# EAGLE design Led Matrix (EAGLE 5.11)
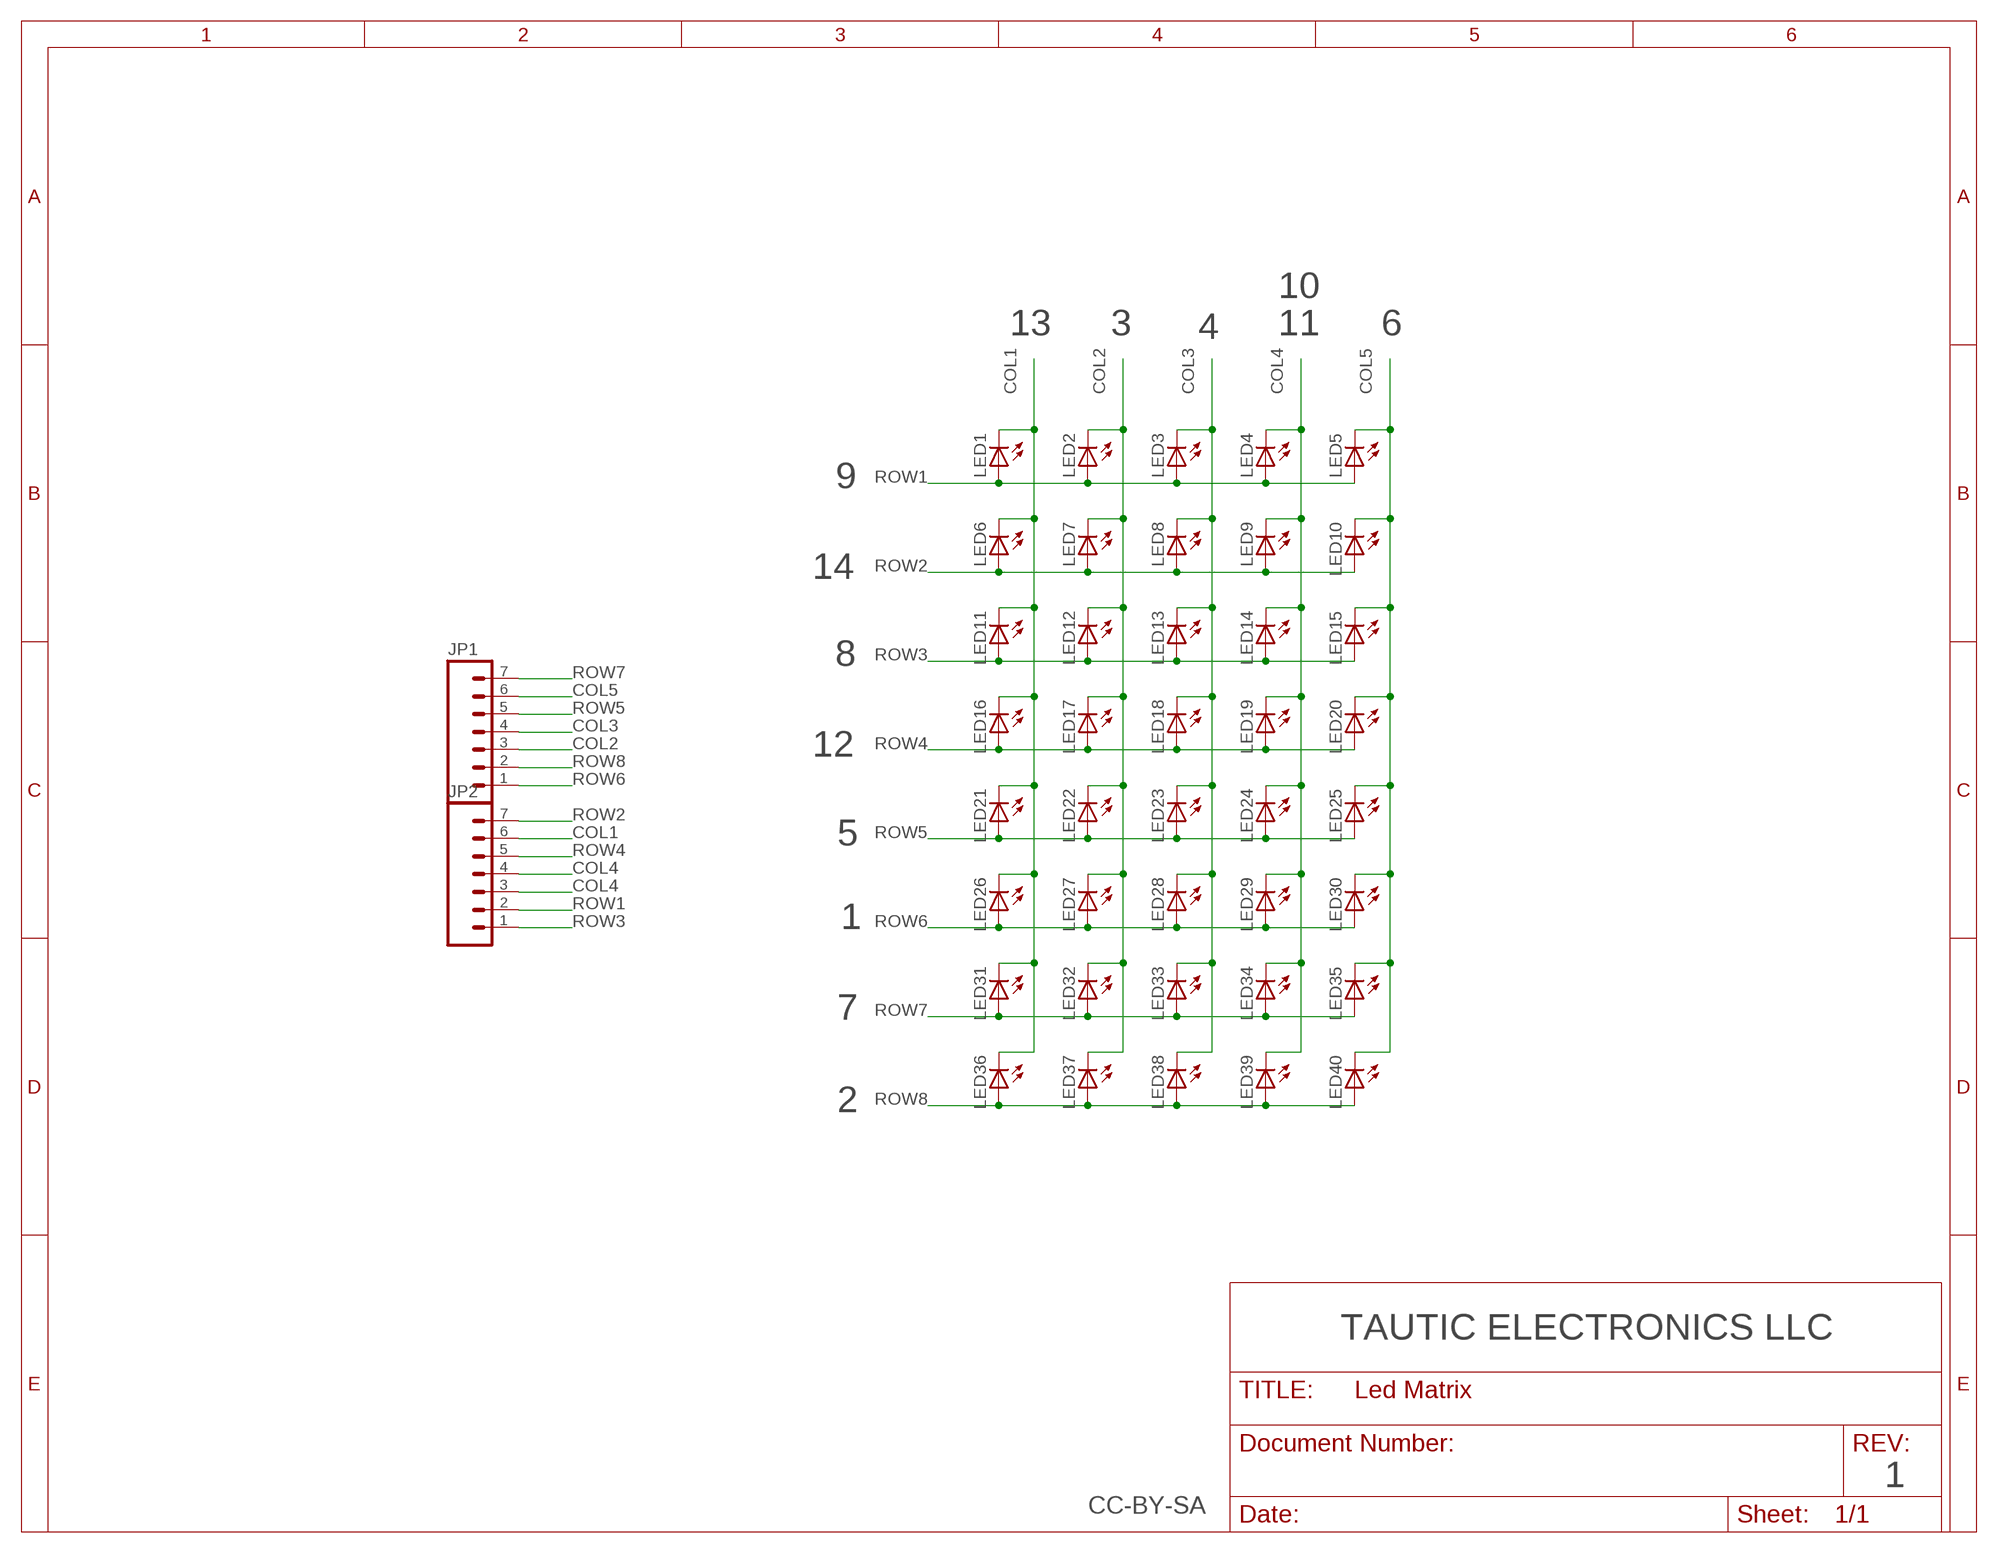
[diagram p0: schematic, sheet 1]

## Parts
JP1  M07LOCK  [1X07_LOCK]
JP2  M07LOCK  [1X07_LOCK]
LED1  LED5MM  [LED5MM]
LED2  LED5MM  [LED5MM]
LED3  LED5MM  [LED5MM]
LED4  LED5MM  [LED5MM]
LED5  LED5MM  [LED5MM]
LED6  LED5MM  [LED5MM]
LED7  LED5MM  [LED5MM]
LED8  LED5MM  [LED5MM]
LED9  LED5MM  [LED5MM]
LED10  LED5MM  [LED5MM]
LED11  LED5MM  [LED5MM]
LED12  LED5MM  [LED5MM]
LED13  LED5MM  [LED5MM]
LED14  LED5MM  [LED5MM]
LED15  LED5MM  [LED5MM]
LED16  LED5MM  [LED5MM]
LED17  LED5MM  [LED5MM]
LED18  LED5MM  [LED5MM]
LED19  LED5MM  [LED5MM]
LED20  LED5MM  [LED5MM]
LED21  LED5MM  [LED5MM]
LED22  LED5MM  [LED5MM]
LED23  LED5MM  [LED5MM]
LED24  LED5MM  [LED5MM]
LED25  LED5MM  [LED5MM]
LED26  LED5MM  [LED5MM]
LED27  LED5MM  [LED5MM]
LED28  LED5MM  [LED5MM]
LED29  LED5MM  [LED5MM]
LED30  LED5MM  [LED5MM]
LED31  LED5MM  [LED5MM]
LED32  LED5MM  [LED5MM]
LED33  LED5MM  [LED5MM]
LED34  LED5MM  [LED5MM]
LED35  LED5MM  [LED5MM]
LED36  LED5MM  [LED5MM]
LED37  LED5MM  [LED5MM]
LED38  LED5MM  [LED5MM]
LED39  LED5MM  [LED5MM]
LED40  LED5MM  [LED5MM]

## Nets
COL1: JP2.6 LED1.K(C) LED6.K(C) LED11.K(C) LED16.K(C) LED21.K(C) LED26.K(C) LED31.K(C) LED36.K(C)
COL2: JP1.3 LED2.K(C) LED7.K(C) LED12.K(C) LED17.K(C) LED22.K(C) LED27.K(C) LED32.K(C) LED37.K(C)
COL3: JP1.4 LED3.K(C) LED8.K(C) LED13.K(C) LED18.K(C) LED23.K(C) LED28.K(C) LED33.K(C) LED38.K(C)
COL4: JP2.3 JP2.4 LED4.K(C) LED9.K(C) LED14.K(C) LED19.K(C) LED24.K(C) LED29.K(C) LED34.K(C) LED39.K(C)
COL5: JP1.6 LED5.K(C) LED10.K(C) LED15.K(C) LED20.K(C) LED25.K(C) LED30.K(C) LED35.K(C) LED40.K(C)
ROW1: JP2.2 LED1.A LED2.A LED3.A LED4.A LED5.A
ROW2: JP2.7 LED6.A LED7.A LED8.A LED9.A LED10.A
ROW3: JP2.1 LED11.A LED12.A LED13.A LED14.A LED15.A
ROW4: JP2.5 LED16.A LED17.A LED18.A LED19.A LED20.A
ROW5: JP1.5 LED21.A LED22.A LED23.A LED24.A LED25.A
ROW6: JP1.1 LED26.A LED27.A LED28.A LED29.A LED30.A
ROW7: JP1.7 LED31.A LED32.A LED33.A LED34.A LED35.A
ROW8: JP1.2 LED36.A LED37.A LED38.A LED39.A LED40.A

## Notes on the sheet
- 10
- 13 | 3 | 4 | 11 | 6
- 9
- 14
- 8
- 12
- 5
- 1
- 7
- 2
- TAUTIC ELECTRONICS LLC
- 1
- CC-BY-SA

## Library data of the parts
JP1 JP2 = SparkFun:M07: Header 7 Standard 7-pin 0.1" header. Use with straight break away headers (SKU : PRT-00116), right angle break away headers (PRT-00553), swiss pins (PRT-00743), machine pins (PRT-00117), and female headers (PRT-00115). NOTES ON THE VARIANTS LOCK and LOCK_LONGPADS... This footprint was designed to help hold the alignment of a through-hole component (i.e. 7-pin header) while soldering it into place. You may notice that each hole has been shifted either up or down by 0.005 of an inch from it's more standard position (which is usually a perfectly straight line). This slight alteration caused the pins (the squares in the middle) to touch the edges of the holes. Because they are alternating, it causes a "brace" to hold the header in place. 0.005 has proven to be the perfect amount of "off-center" position when using our standard breakaway headers. Although looks a little odd when you look at the bare footprint, once you have a header in there, the alteration is very hard to notice. Also, if you push a header all the way into place, it is covered up entirely on the bottom side. This idea of altering the position of holes to aid alignment will be further integrated into the Sparkfun Library for other footprints. It can help hold any component with 3 or more connection pins.
LED1-LED40 = led:LED: LED OSRAM: - CHIPLED LG R971, LG N971, LY N971, LG Q971, LY Q971, LO R971, LY R971 LH N974, LH R974 LS Q976, LO Q976, LY Q976 LO Q996 - Hyper CHIPLED LW Q18S LB Q993, LB Q99A, LB R99A - SideLED LS A670, LO A670, LY A670, LG A670, LP A670 LB A673, LV A673, LT A673, LW A673 LH A674 LY A675 LS A676, LA A676, LO A676, LY A676, LW A676 LS A679, LY A679, LG A679 - Hyper Micro SIDELED® LS Y876, LA Y876, LO Y876, LY Y876 LT Y87S - SmartLED LW L88C, LW L88S LB L89C, LB L89S, LG L890 LS L89K, LO L89K, LY L89K LS L896, LA L896, LO L896, LY L896 - TOPLED LS T670, LO T670, LY T670, LG T670, LP T670 LSG T670, LSP T670, LSY T670, LOP T670, LYG T670 LG T671, LOG T671, LSG T671 LB T673, LV T673, LT T673, LW T673 LH T674 LS T676, LA T676, LO T676, LY T676, LB T676, LH T676, LSB T676, LW T676 LB T67C, LV T67C, LT T67C, LS T67K, LO T67K, LY T67K, LW E67C LS E67B, LA E67B, LO E67B, LY E67B, LB E67C, LV E67C, LT E67C LW T67C LS T679, LY T679, LG T679 LS T770, LO T770, LY T770, LG T770, LP T770 LB T773, LV T773, LT T773, LW T773 LH T774 LS E675, LA E675, LY E675, LS T675 LS T776, LA T776, LO T776, LY T776, LB T776 LHGB T686 LT T68C, LB T68C - Hyper Mini TOPLED® LB M676 - Mini TOPLED Santana® LG M470 LS M47K, LO M47K, LY M47K Source: http://www.osram.convergy.de LUXEON: - LUMILED® LXK2-PW12-R00, LXK2-PW12-S00, LXK2-PW14-U00, LXK2-PW14-V00 LXK2-PM12-R00, LXK2-PM12-S00, LXK2-PM14-U00 LXK2-PE12-Q00, LXK2-PE12-R00, LXK2-PE12-S00, LXK2-PE14-T00, LXK2-PE14-U00 LXK2-PB12-K00, LXK2-PB12-L00, LXK2-PB12-M00, LXK2-PB14-N00, LXK2-PB14-P00, LXK2-PB14-Q00 LXK2-PR12-L00, LXK2-PR12-M00, LXK2-PR14-Q00, LXK2-PR14-R00 LXK2-PD12-Q00, LXK2-PD12-R00, LXK2-PD12-S00 LXK2-PH12-R00, LXK2-PH12-S00 LXK2-PL12-P00, LXK2-PL12-Q00, LXK2-PL12-R00 Source: www.luxeon.com KINGBRIGHT: KA-3528ASYC Source: www.kingbright.com

## Board
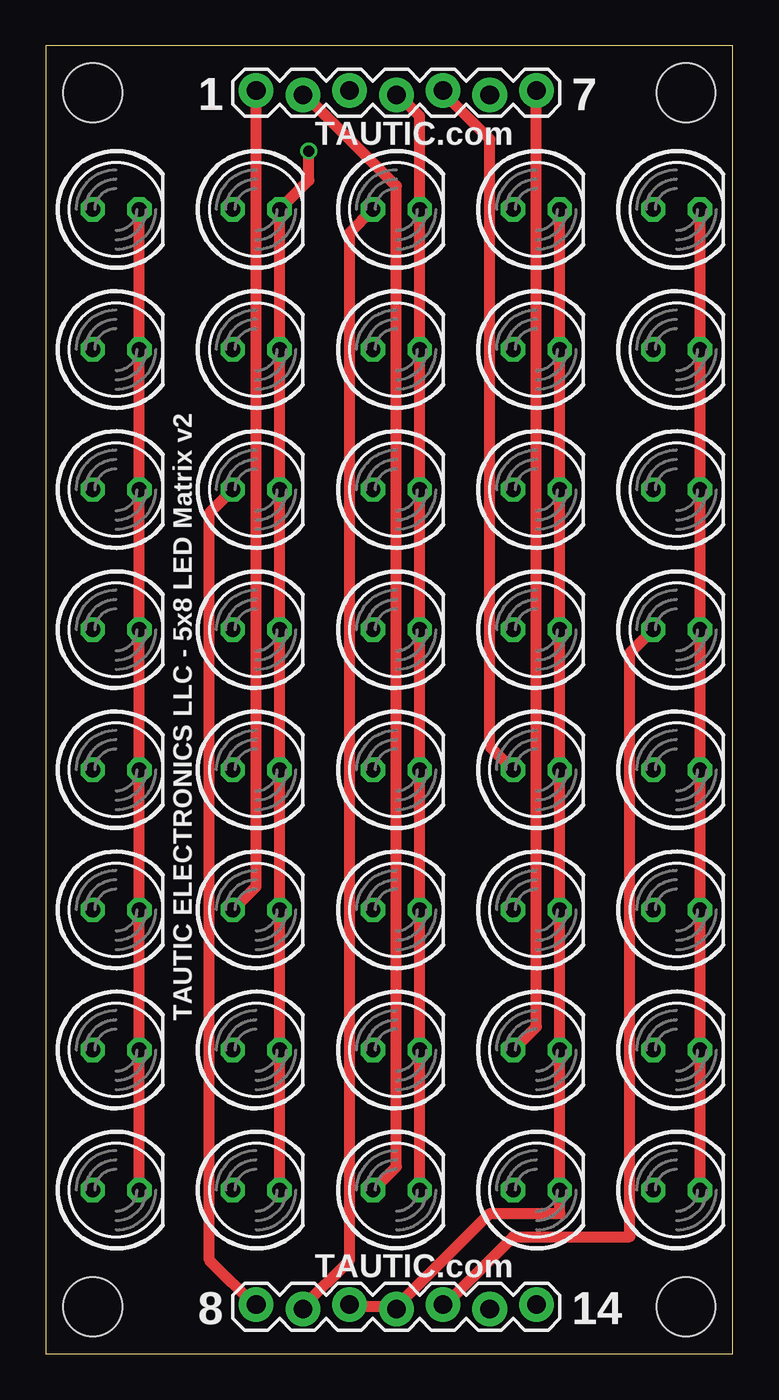
[diagram p1: board, top side]
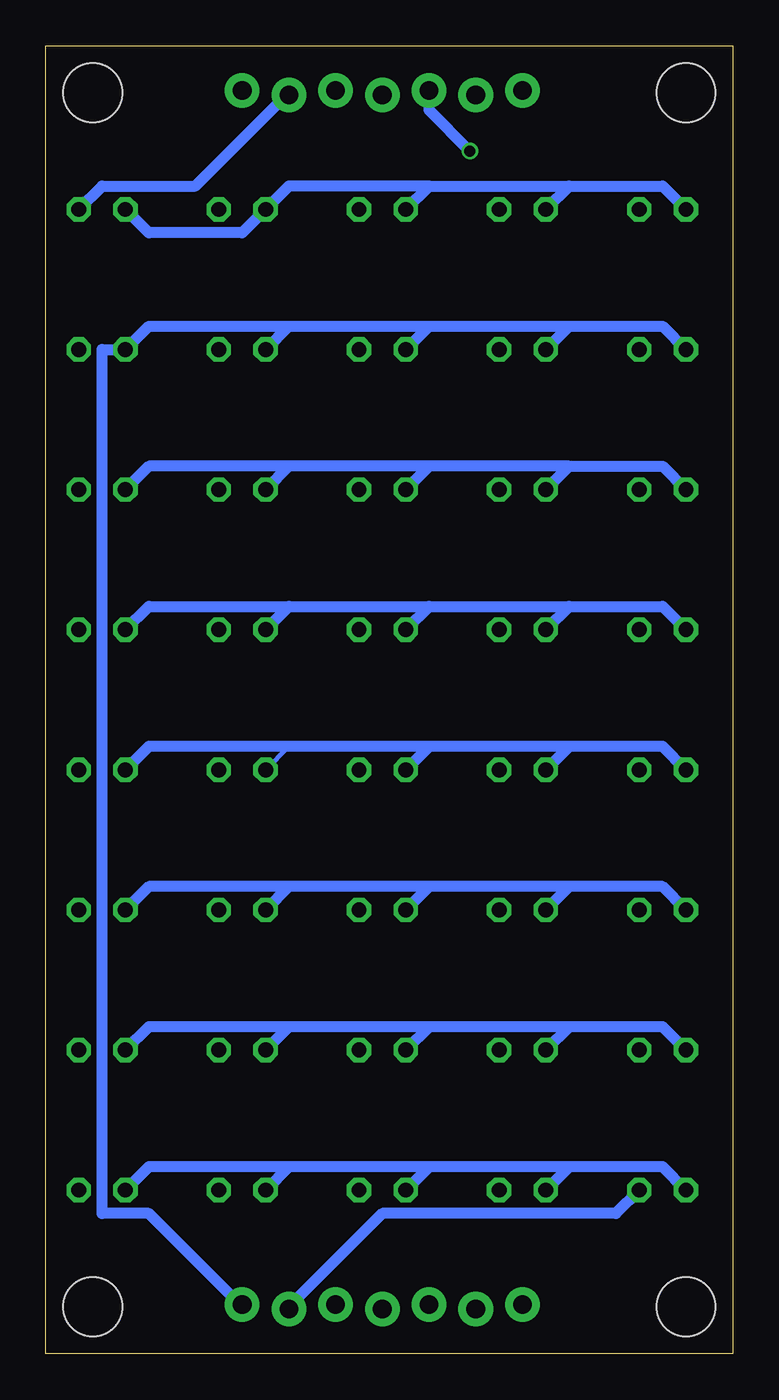
[diagram p2: board, bottom side, seen from below]

Size 37.34 x 71.12 mm. Coordinates in mm from the lower left corner, seen from the top.
Outline: 0,0 37.34,0 37.34,71.12 0,71.12 0,0
Copper layers (1*16): Top 0.035mm / dielectric 1.5mm / Bottom 0.035mm
Design rules "ITead_rule *": minimum track width 6mil, minimum drill 12mil, track to track 10mil, track to pad 10mil, pad to pad 10mil, via to via 6mil, smd to smd 0mil, copper to edge 10mil, drill to drill 10mil, minimum pad ring 10mil, minimum via ring 6mil, stop-mask expansion 2mil, vias tented up to drill 100mil, thermal gap 10mil
Holes 3.2 mm at 2.54,2.54 2.54,68.58 34.8,2.54 34.8,68.58

### Footprints (pad centres in the part's own frame; a part is rotated, then mirrored left to right if it is on the bottom)
1X07_LOCK = drill 1.016 pad 1.88 round: 1 0,0.127; 2 2.54,-0.127; 3 5.08,0.127; 4 7.62,-0.127; 5 10.16,0.127; 6 12.7,-0.127; 7 15.24,0.127
LED5MM = drill 0.813 octagon: A -1.27,0; K 1.27,0

### Placement (x,y rotation side)
JP1  11.43,68.58 0 top
JP2  11.43,2.54 0 top
LED1  3.81,62.23 0 top
LED2  11.43,62.23 0 top
LED3  19.05,62.23 0 top
LED4  26.67,62.23 0 top
LED5  34.29,62.23 0 top
LED6  3.81,54.61 0 top
LED7  11.43,54.61 0 top
LED8  19.05,54.61 0 top
LED9  26.67,54.61 0 top
LED10  34.29,54.61 0 top
LED11  3.81,46.99 0 top
LED12  11.43,46.99 0 top
LED13  19.05,46.99 0 top
LED14  26.67,46.99 0 top
LED15  34.29,46.99 0 top
LED16  3.81,39.37 0 top
LED17  11.43,39.37 0 top
LED18  19.05,39.37 0 top
LED19  26.67,39.37 0 top
LED20  34.29,39.37 0 top
LED21  3.81,31.75 0 top
LED22  11.43,31.75 0 top
LED23  19.05,31.75 0 top
LED24  26.67,31.75 0 top
LED25  34.29,31.75 0 top
LED26  3.81,24.13 0 top
LED27  11.43,24.13 0 top
LED28  19.05,24.13 0 top
LED29  26.67,24.13 0 top
LED30  34.29,24.13 0 top
LED31  3.81,16.51 0 top
LED32  11.43,16.51 0 top
LED33  19.05,16.51 0 top
LED34  26.67,16.51 0 top
LED35  34.29,16.51 0 top
LED36  3.81,8.89 0 top
LED37  11.43,8.89 0 top
LED38  19.05,8.89 0 top
LED39  26.67,8.89 0 top
LED40  34.29,8.89 0 top

### Tracks (layer width: path | path; a pad name or v marks a point on that pad's centre or on a via)
COL1
  Top 0.61: LED1.K LED6.K LED11.K LED16.K LED21.K LED26.K LED31.K LED36.K
  Bottom 0.254: 24.13,2.54 JP2.6
  Bottom 0.61: 24.13,2.54 19.05,7.62 6.35,7.62 LED36.K
COL2  (via drill 0.6)
  Top 0.61: LED37.K LED32.K LED27.K LED22.K LED17.K LED12.K LED7.K LED2.K 14.29,63.82 v14.29,65.41
  Bottom 0.61: v14.29,65.41 16.51,67.63 JP1.3
COL3
  Top 0.254: 19.05,68.58 JP1.4
  Top 0.61: 19.05,68.58 20.32,67.31 LED3.K LED8.K LED13.K LED18.K LED23.K LED28.K LED33.K LED38.K
COL4
  Top 0.254: JP2.4 19.05,2.54
  Top 0.61: LED4.K LED9.K LED14.K LED19.K LED24.K LED29.K LED34.K LED39.K 27.94,7.62 24.13,7.62 19.05,2.54 16.51,2.54 JP2.3
COL5
  Top 0.61: LED5.K LED10.K LED15.K LED20.K LED25.K LED30.K LED35.K LED40.K
  Bottom 0.254: 24.13,68.58 JP1.6
  Bottom 0.61: 24.13,68.58 29.21,63.5 34.29,63.5 LED5.K
ROW1
  Top 0.254: JP2.2 13.97,2.54
  Top 0.61: 13.97,2.54 16.51,5.08 16.51,60.96 LED3.A
  Bottom 0.61: LED1.A 3.81,63.5 8.89,63.5 | 8.89,63.5 LED2.A | LED3.A 16.51,63.5 | 16.51,63.5 8.89,63.5 | 16.51,63.5 24.13,63.5 LED4.A 26.67,60.96 31.75,60.96 LED5.A
ROW2
  Bottom 0.254: JP2.7 26.67,2.54
  Bottom 0.61: LED6.A 3.81,55.88 8.89,55.88 | 8.89,55.88 LED7.A | 16.51,55.88 LED8.A | 16.51,55.88 8.89,55.88 | 24.13,55.88 LED9.A | 24.13,55.88 16.51,55.88 | 24.13,55.88 31.75,55.88 LED10.A 34.29,54.61 34.29,7.62 31.75,7.62 26.67,2.54
ROW3
  Top 0.254: JP2.1 11.43,2.54
  Top 0.61: 11.43,2.54 8.89,5.08 8.89,45.72 LED12.A
  Bottom 0.61: LED11.A 3.81,48.26 8.89,48.26 | LED12.A 8.89,48.26 | 16.51,48.26 LED13.A | 8.89,48.26 16.51,48.26 | 24.13,48.26 LED14.A | 16.51,48.26 24.13,48.26 | LED15.A 31.75,48.26 24.13,48.26
ROW4
  Top 0.254: JP2.5 21.59,2.54
  Top 0.61: 21.59,2.54 25.4,6.35 31.75,6.35 31.75,38.1 LED20.A
  Bottom 0.61: LED16.A 3.81,40.64 8.89,40.64 | 8.89,40.64 LED17.A | 16.51,40.64 LED18.A | 16.51,40.64 8.89,40.64 | 24.13,40.64 LED19.A | 24.13,40.64 16.51,40.64 | LED20.A 31.75,40.64 24.13,40.64
ROW5
  Top 0.254: 21.59,68.58 JP1.5
  Top 0.61: 21.59,68.58 24.13,66.04 24.13,33.02 LED24.A
  Bottom 0.254: 24.13,33.02 LED24.A
  Bottom 0.61: LED21.A 3.81,33.02 8.89,33.02 | 8.89,33.02 LED22.A | 16.51,33.02 LED23.A | 8.89,33.02 16.51,33.02 | 16.51,33.02 24.13,33.02 31.75,33.02 LED25.A
ROW6
  Top 0.61: LED27.A 11.43,25.4 JP1.1
  Bottom 0.61: LED26.A 3.81,25.4 8.89,25.4 | 8.89,25.4 LED27.A | 16.51,25.4 LED28.A | 8.89,25.4 16.51,25.4 | 24.13,25.4 LED29.A | 16.51,25.4 24.13,25.4 | LED30.A 31.75,25.4 24.13,25.4
ROW7
  Top 0.61: LED34.A 26.67,17.78 JP1.7
  Bottom 0.61: LED31.A 3.81,17.78 8.89,17.78 | 8.89,17.78 LED32.A | 16.51,17.78 LED33.A | 8.89,17.78 16.51,17.78 | 24.13,17.78 LED34.A | 16.51,17.78 24.13,17.78 | LED35.A 31.75,17.78 24.13,17.78
ROW8
  Top 0.254: 13.97,68.58 JP1.2
  Top 0.61: 13.97,68.58 19.05,63.5 19.05,10.16 LED38.A
  Bottom 0.61: LED36.A 3.81,10.16 8.89,10.16 | 8.89,10.16 LED37.A | 16.51,10.16 LED38.A | 8.89,10.16 16.51,10.16 | 24.13,10.16 LED39.A | 16.51,10.16 24.13,10.16 | LED40.A 31.75,10.16 24.13,10.16

### Text on the board
tNames: 1 | 7 | TAUTIC.com | TAUTIC ELECTRONICS LLC - 5x8 LED Matrix v2 | TAUTIC.com | 8 | 14
bStop: TAUTIC.COM | v2